# Altium schematic sheet SHEET1.SCHDOC
size A4
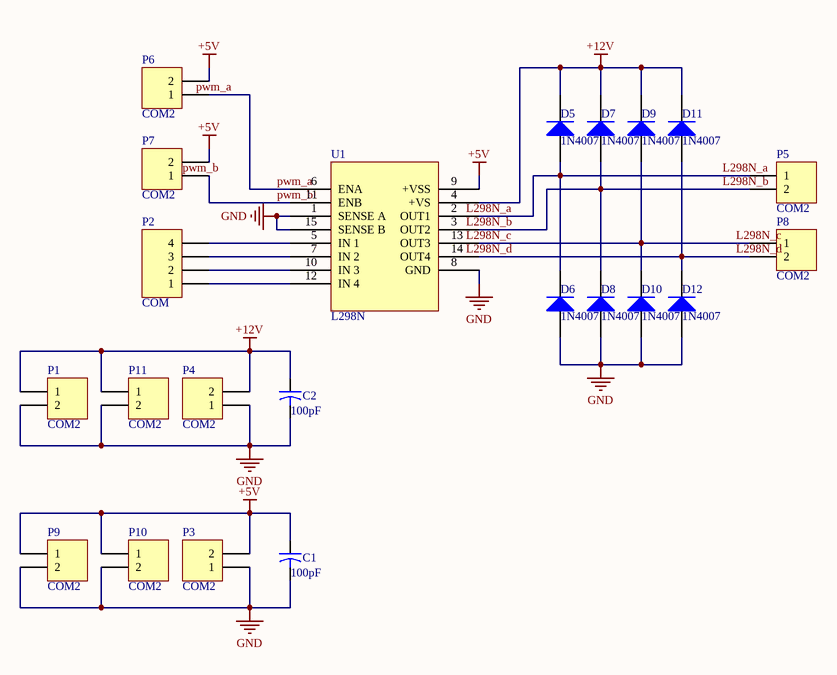
[diagram p0: SHEET1.SCHDOC]

## Parts
C1  value 100pF  [CAPR5-4X5]
C2  value 100pF  [CAPR5-4X5]
D5  1N4007  [DO-41]
D6  1N4007  [DO-41]
D7  1N4007  [DO-41]
D8  1N4007  [DO-41]
D9  1N4007  [DO-41]
D10  1N4007  [DO-41]
D11  1N4007  [DO-41]
D12  1N4007  [DO-41]
P1  COM2  [HDR1X2]
P2  COM  [HDR1X4]
P3  COM2  [HDR1X2]
P4  COM2  [DP3]
P5  COM2  [DP3]
P6  COM2  [HDR1X2]
P7  COM2  [HDR1X2]
P8  COM2  [DP3]
P9  COM2  [HDR1X2]
P10  COM2  [HDR1X2]
P11  COM2  [HDR1X2]
U1  L298N  [L298N - duplicate]

## Nets
+5V: C1.1 P3.2 P6.2 P7.2 P9.1 P10.1 U1.9(+VSS)
+12V: C2.1 D5.2(K) D7.2(K) D9.2(K) D11.2(K) P1.1 P4.2 P11.1 U1.4(+VS)
GND: C1.2 C2.2 D6.1(A) D8.1(A) D10.1(A) D12.1(A) P1.2 P3.1 P4.1 P9.2 P10.2 P11.2 U1.1(SENSE_A) U1.8(GND) U1.15(SENSE_B)
L298N_a: D5.1(A) D6.2(K) P5.1 U1.2(OUT1)
L298N_b: D7.1(A) D8.2(K) P5.2 U1.3(OUT2)
L298N_c: D9.1(A) D10.2(K) P8.1 U1.13(OUT3)
L298N_d: D11.1(A) D12.2(K) P8.2 U1.14(OUT4)
pwm_a: P6.1 U1.6(ENA)
pwm_b: P7.1 U1.11(ENB)
NetP2_1: P2.1 U1.12(IN_4)
NetP2_2: P2.2 U1.10(IN_3)
NetP2_3: P2.3 U1.7(IN_2)
NetP2_4: P2.4 U1.5(IN_1)

## Notes on the sheet
- Labels drawn without touching a wire or pin: L298N_a, L298N_b, L298N_c, L298N_d, pwm_a, pwm_b

## Library data of the parts
C1 C2 = Cap2: Capacitor; Published: 23-Sep-2002; PackageReference: CAPR5-4X5; Publisher: Altium Limited
D5-D12 = Diode 1N4007: 1 Amp General Purpose Rectifier; Published: 8-Jun-2000; LatestRevisionDate: 17-Jul-2002; LatestRevisionNote: Re-released for DXP Platform.; DatasheetDocument: 1998; PackageDocument: Aug-1999; PackageReference: DO-41; Publisher: Altium Limited; Code_JEDEC: DO-204-AL; ComponentLink1Description: Manufacturer Link; ComponentLink1URL: http://www.fairchildsemi.com/; ComponentLink2Description: Datasheet; ComponentLink2URL: http://www.fairchildsemi.com/ds/1N%2F1N4001.pdf
P1 P3-P11 = Header 2: Header, 2-Pin; LatestRevisionDate: 17-Jul-2002; LatestRevisionNote: Re-released for DXP Platform.; Publisher: Altium Limited
P2 = Header 4: Header, 4-Pin; LatestRevisionDate: 17-Jul-2002; LatestRevisionNote: Re-released for DXP Platform.; Publisher: Altium Limited